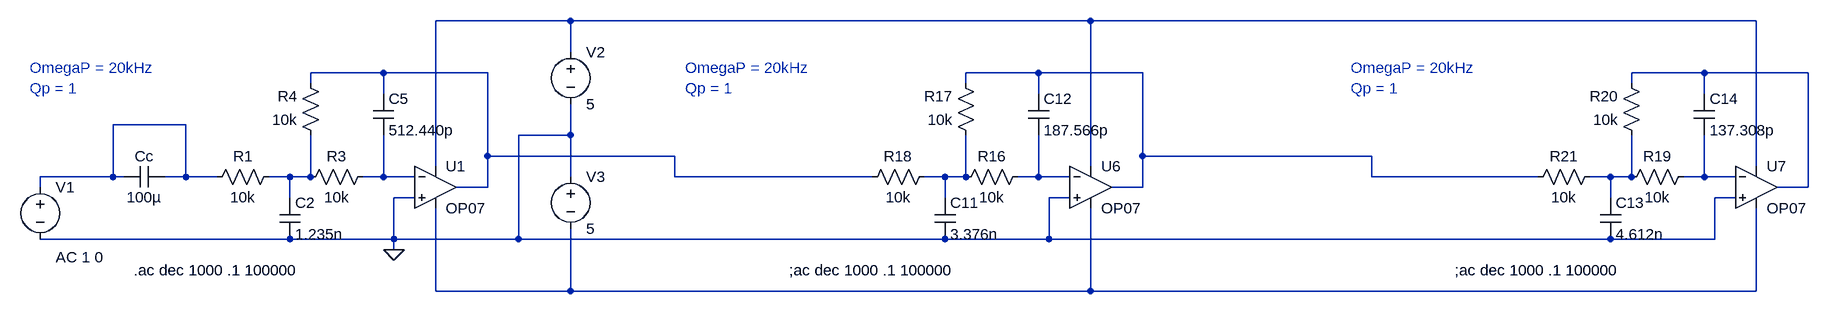
[diagram p0: schematic MultiFeedSchem.asc]
MultiFeedSchem.asc, the LTspice schematic file:
Version 4
SHEET 1 2588 2420
WIRE 480 -96 272 -96
WIRE 1280 -96 480 -96
WIRE 2304 -96 1280 -96
WIRE 480 -48 480 -96
WIRE 192 -16 80 -16
WIRE 352 -16 192 -16
WIRE 1200 -16 1088 -16
WIRE 1360 -16 1200 -16
WIRE 2224 -16 2112 -16
WIRE 2384 -16 2224 -16
WIRE 80 0 80 -16
WIRE 1088 0 1088 -16
WIRE 2112 0 2112 -16
WIRE 192 16 192 -16
WIRE 1200 16 1200 -16
WIRE 2224 16 2224 -16
WIRE -112 64 -224 64
WIRE 480 80 480 32
WIRE 480 80 400 80
WIRE 352 112 352 -16
WIRE 640 112 352 112
WIRE 1360 112 1360 -16
WIRE 1712 112 1360 112
WIRE 272 128 272 -96
WIRE 1280 128 1280 -96
WIRE 2304 128 2304 -96
WIRE -224 144 -224 64
WIRE -224 144 -336 144
WIRE -208 144 -224 144
WIRE -112 144 -112 64
WIRE -112 144 -144 144
WIRE -64 144 -112 144
WIRE 48 144 16 144
WIRE 80 144 80 80
WIRE 80 144 48 144
WIRE 192 144 192 80
WIRE 192 144 160 144
WIRE 240 144 192 144
WIRE 480 144 480 80
WIRE 640 144 640 112
WIRE 944 144 640 144
WIRE 1056 144 1024 144
WIRE 1088 144 1088 80
WIRE 1088 144 1056 144
WIRE 1200 144 1200 80
WIRE 1200 144 1168 144
WIRE 1248 144 1200 144
WIRE 1712 144 1712 112
WIRE 1968 144 1712 144
WIRE 2080 144 2048 144
WIRE 2112 144 2112 80
WIRE 2112 144 2080 144
WIRE 2224 144 2224 80
WIRE 2224 144 2192 144
WIRE 2272 144 2224 144
WIRE -336 160 -336 144
WIRE 352 160 352 112
WIRE 352 160 304 160
WIRE 1360 160 1360 112
WIRE 1360 160 1312 160
WIRE 2384 160 2384 -16
WIRE 2384 160 2336 160
WIRE 48 176 48 144
WIRE 240 176 208 176
WIRE 1056 176 1056 144
WIRE 1248 176 1216 176
WIRE 2080 176 2080 144
WIRE 2272 176 2240 176
WIRE 48 240 -336 240
WIRE 208 240 208 176
WIRE 208 240 48 240
WIRE 400 240 400 80
WIRE 400 240 208 240
WIRE 1056 240 400 240
WIRE 1216 240 1216 176
WIRE 1216 240 1056 240
WIRE 2080 240 1216 240
WIRE 2240 240 2240 176
WIRE 2240 240 2080 240
WIRE 208 256 208 240
WIRE 272 320 272 192
WIRE 480 320 480 224
WIRE 480 320 272 320
WIRE 1280 320 1280 192
WIRE 1280 320 480 320
WIRE 2304 320 2304 192
WIRE 2304 320 1280 320
FLAG 208 256 0
SYMBOL Opamps\\OP07 272 96 R0
SYMATTR InstName U1
SYMBOL res 176 128 R90
WINDOW 0 0 56 VBottom 2
WINDOW 3 32 56 VTop 2
SYMATTR InstName R3
SYMATTR Value 10k
SYMBOL res 96 96 R180
WINDOW 0 36 76 Left 2
WINDOW 3 36 40 Left 2
SYMATTR InstName R4
SYMATTR Value 10k
SYMBOL res -80 160 R270
WINDOW 0 32 56 VTop 2
WINDOW 3 0 56 VBottom 2
SYMATTR InstName R1
SYMATTR Value 10k
SYMBOL cap 32 176 R0
SYMATTR InstName C2
SYMATTR Value 1.235n
SYMBOL cap 176 16 R0
SYMATTR InstName C5
SYMATTR Value 512.440p
SYMBOL voltage -336 144 R0
WINDOW 123 24 124 Left 2
WINDOW 39 0 0 Left 2
SYMATTR Value2 AC 1 0
SYMATTR InstName V1
SYMATTR Value ""
SYMBOL voltage 480 -64 R0
SYMATTR InstName V2
SYMATTR Value 5
SYMBOL voltage 480 128 R0
SYMATTR InstName V3
SYMATTR Value 5
SYMBOL cap -144 128 R90
WINDOW 0 0 32 VBottom 2
WINDOW 3 32 32 VTop 2
SYMATTR InstName Cc
SYMATTR Value 100µ
SYMBOL Opamps\\OP07 1280 96 R0
SYMATTR InstName U6
SYMBOL res 1184 128 R90
WINDOW 0 0 56 VBottom 2
WINDOW 3 32 56 VTop 2
SYMATTR InstName R16
SYMATTR Value 10k
SYMBOL res 1104 96 R180
WINDOW 0 36 76 Left 2
WINDOW 3 36 40 Left 2
SYMATTR InstName R17
SYMATTR Value 10k
SYMBOL res 928 160 R270
WINDOW 0 32 56 VTop 2
WINDOW 3 0 56 VBottom 2
SYMATTR InstName R18
SYMATTR Value 10k
SYMBOL cap 1040 176 R0
SYMATTR InstName C11
SYMATTR Value 3.376n
SYMBOL cap 1184 16 R0
SYMATTR InstName C12
SYMATTR Value 187.566p
SYMBOL Opamps\\OP07 2304 96 R0
SYMATTR InstName U7
SYMBOL res 2208 128 R90
WINDOW 0 0 56 VBottom 2
WINDOW 3 32 56 VTop 2
SYMATTR InstName R19
SYMATTR Value 10k
SYMBOL res 2128 96 R180
WINDOW 0 36 76 Left 2
WINDOW 3 36 40 Left 2
SYMATTR InstName R20
SYMATTR Value 10k
SYMBOL res 1952 160 R270
WINDOW 0 32 56 VTop 2
WINDOW 3 0 56 VBottom 2
SYMATTR InstName R21
SYMATTR Value 10k
SYMBOL cap 2064 176 R0
SYMATTR InstName C13
SYMATTR Value 4.612n
SYMBOL cap 2208 16 R0
SYMATTR InstName C14
SYMATTR Value 137.308p
TEXT -192 288 Left 2 !.ac dec 1000 .1 100000
TEXT -352 -24 Left 2 ;OmegaP = 20kHz
TEXT -352 8 Left 2 ;Qp = 1
TEXT 816 288 Left 2 !;ac dec 1000 .1 100000
TEXT 656 -24 Left 2 ;OmegaP = 20kHz
TEXT 656 8 Left 2 ;Qp = 1
TEXT 1840 288 Left 2 !;ac dec 1000 .1 100000
TEXT 1680 -24 Left 2 ;OmegaP = 20kHz
TEXT 1680 8 Left 2 ;Qp = 1

The netlist it stands for:
* MultiFeedSchem.asc
XU1 0 N007 N001 N012 N002 LT1001  ; OP07, pins In+ In- V+ V- OUT
R3 N007 N006 10k
R4 N006 N002 10k
R1 N005 N006 10k
C2 N006 0 1.235n
C5 N002 N007 512.440p
V1 N005 0 AC 1 0
V2 N001 0 5
V3 0 N012 5
Cc N005 N005 100µ
XU6 0 N009 N001 N012 N003 LT1001  ; OP07, pins In+ In- V+ V- OUT
R16 N009 N008 10k
R17 N008 N003 10k
R18 N002 N008 10k
C11 N008 0 3.376n
C12 N003 N009 187.566p
XU7 0 N011 N001 N012 N004 LT1001  ; OP07, pins In+ In- V+ V- OUT
R19 N011 N010 10k
R20 N010 N004 10k
R21 N003 N010 10k
C13 N010 0 4.612n
C14 N004 N011 137.308p
.ac dec 1000 .1 100000
* OmegaP = 20kHz
* Qp = 1
;ac dec 1000 .1 100000
* OmegaP = 20kHz
* Qp = 1
;ac dec 1000 .1 100000
* OmegaP = 20kHz
* Qp = 1
.lib LTC.lib
.backanno
.end